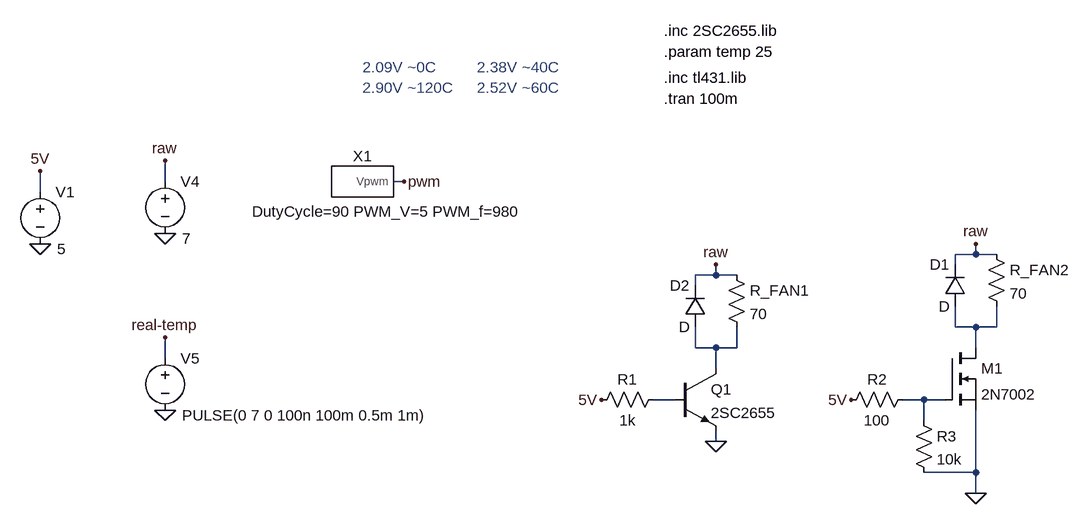
[diagram p0: schematic fan-alternative.asc]
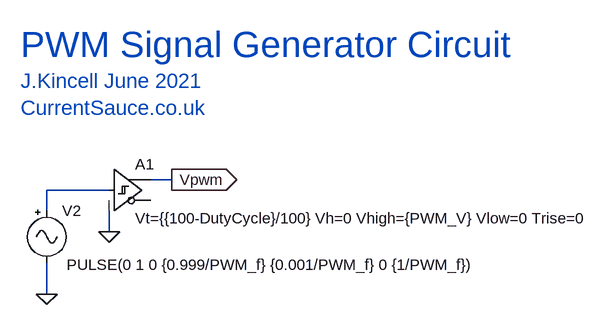
[diagram p1: sub-circuit pwm_gen.asc]
fan-alternative.asc, the LTspice schematic file:
Version 4
SHEET 1 1448 1004
WIRE -208 400 -208 368
WIRE 160 400 144 400
WIRE -400 416 -400 384
WIRE 1040 512 1040 496
WIRE 1040 512 1008 512
WIRE 1072 512 1040 512
WIRE 1008 528 1008 512
WIRE 640 544 640 528
WIRE 640 544 608 544
WIRE 672 544 640 544
WIRE 608 560 608 544
WIRE 1008 624 1008 592
WIRE 1040 624 1008 624
WIRE 1072 624 1072 592
WIRE 1072 624 1040 624
WIRE 608 656 608 624
WIRE 640 656 608 656
WIRE 672 656 672 624
WIRE 672 656 640 656
WIRE 1040 656 1040 624
WIRE -208 672 -208 640
WIRE 640 688 640 656
WIRE 576 736 544 736
WIRE 960 736 928 736
WIRE 992 736 960 736
WIRE 960 768 960 736
WIRE 640 800 640 784
WIRE 1040 848 1040 752
WIRE 1040 848 960 848
WIRE 1040 880 1040 848
FLAG -208 480 0
FLAG -208 368 raw
FLAG -208 752 0
FLAG -208 640 real-temp
FLAG 640 528 raw
FLAG 640 800 0
FLAG 160 400 pwm
FLAG 464 736 5V
FLAG -400 496 0
FLAG -400 384 5V
FLAG 1040 496 raw
FLAG 1040 880 0
FLAG 848 736 5V
SYMBOL voltage -208 384 R0
WINDOW 3 26 104 Left 2
WINDOW 123 0 0 Left 0
WINDOW 39 0 0 Left 0
SYMATTR Value 7
SYMATTR InstName V4
SYMBOL voltage -208 656 R0
WINDOW 3 26 104 Left 2
WINDOW 123 0 0 Left 0
WINDOW 39 0 0 Left 0
SYMATTR Value PULSE(0 7 0 100n 100m 0.5m 1m)
SYMATTR InstName V5
SYMBOL npn 576 688 R0
SYMATTR InstName Q1
SYMATTR Value 2SC2655
SYMBOL res 656 528 R0
SYMATTR InstName R_FAN1
SYMATTR Value 70
SYMBOL diode 624 624 R180
WINDOW 0 24 64 Left 2
WINDOW 3 24 0 Left 2
SYMATTR InstName D2
SYMBOL res 560 720 R90
WINDOW 0 0 56 VBottom 2
WINDOW 3 32 56 VTop 2
SYMATTR InstName R1
SYMATTR Value 1k
SYMBOL PWM_Gen 96 400 R0
WINDOW 39 37 62 Bottom 2
SYMATTR SpiceLine DutyCycle=90 PWM_V=5 PWM_f=980
SYMATTR InstName X1
SYMBOL voltage -400 400 R0
WINDOW 3 26 104 Left 2
WINDOW 123 0 0 Left 0
WINDOW 39 0 0 Left 0
SYMATTR Value 5
SYMATTR InstName V1
SYMBOL res 1056 496 R0
SYMATTR InstName R_FAN2
SYMATTR Value 70
SYMBOL diode 1024 592 R180
WINDOW 0 24 64 Left 2
WINDOW 3 24 0 Left 2
SYMATTR InstName D1
SYMBOL res 944 720 R90
WINDOW 0 0 56 VBottom 2
WINDOW 3 32 56 VTop 2
SYMATTR InstName R2
SYMATTR Value 100
SYMBOL nmos 992 656 R0
SYMATTR InstName M1
SYMATTR Value 2N7002
SYMBOL res 944 752 R0
SYMATTR InstName R3
SYMATTR Value 10k
TEXT 560 272 Left 2 !.tran 100m
TEXT 96 224 Left 2 ;2.09V ~0C\n2.90V ~120C
TEXT 272 224 Left 2 ;2.38V ~40C\n2.52V ~60C
TEXT 560 240 Left 2 !.inc tl431.lib
TEXT 560 200 Left 2 !.param temp 25
TEXT 560 168 Left 2 !.inc 2SC2655.lib

pwm_gen.asc, the sub-circuit schematic file:
Version 4
SHEET 1 880 680
WIRE -1296 64 -1328 64
WIRE -1392 80 -1488 80
WIRE -1488 112 -1488 80
WIRE -1392 144 -1392 112
WIRE -1488 240 -1488 192
FLAG -1488 240 0
FLAG -1296 64 Vpwm
IOPIN -1296 64 Out
FLAG -1392 144 0
SYMBOL Misc\\signal -1488 96 R0
WINDOW 123 0 0 Left 0
WINDOW 39 0 0 Left 0
WINDOW 3 31 99 Left 2
SYMATTR Value PULSE(0 1 0 {0.999/PWM_f} {0.001/PWM_f} 0 {1/PWM_f})
SYMATTR InstName V2
SYMBOL Digital\\schmitt -1392 16 R0
WINDOW 3 40 107 Left 2
SYMATTR Value Vt={{100-DutyCycle}/100} Vh=0 Vhigh={PWM_V} Vlow=0 Trise=0
SYMATTR InstName A1
TEXT -1528 -144 Left 5 ;PWM Signal Generator Circuit
TEXT -1528 -88 Left 3 ;J.Kincell June 2021\nCurrentSauce.co.uk

The netlist it stands for:
* fan-alternative.asc
V4 raw 0 7
V5 real-temp 0 PULSE(0 7 0 100n 100m 0.5m 1m)
Q1 N002 N003 0 0 2SC2655
R_FAN1 raw N002 70
D2 N002 raw D
R1 N003 5V 1k
XX1 pwm pwm_gen params: DutyCycle=90 PWM_V=5 PWM_f=980
V1 5V 0 5
R_FAN2 raw N001 70
D1 N001 raw D
R2 N004 5V 100
M1 N001 N004 0 0 2N7002
R3 N004 0 10k

* block symbol definitions
.subckt pwm_gen Vpwm
V2 N001 0 PULSE(0 1 0 {0.999/PWM_f} {0.001/PWM_f} 0 {1/PWM_f})
A1 N001 0 0 0 0 0 Vpwm 0 SCHMITT Vt={{100-DutyCycle}/100} Vh=0 Vhigh={PWM_V} Vlow=0 Trise=0
* PWM Signal Generator Circuit
* J.Kincell June 2021
* CurrentSauce.co.uk
.ends pwm_gen

.model D D
.lib standard.dio
.model NPN NPN
.model PNP PNP
.lib standard.bjt
.model NMOS NMOS
.model PMOS PMOS
.lib standard.mos
.tran 100m
* 2.09V ~0C
* 2.90V ~120C
* 2.38V ~40C
* 2.52V ~60C
.inc tl431.lib
.param temp 25
.inc 2SC2655.lib
.backanno
.end